# EAGLE design M306X (EAGLE 6.6.0)
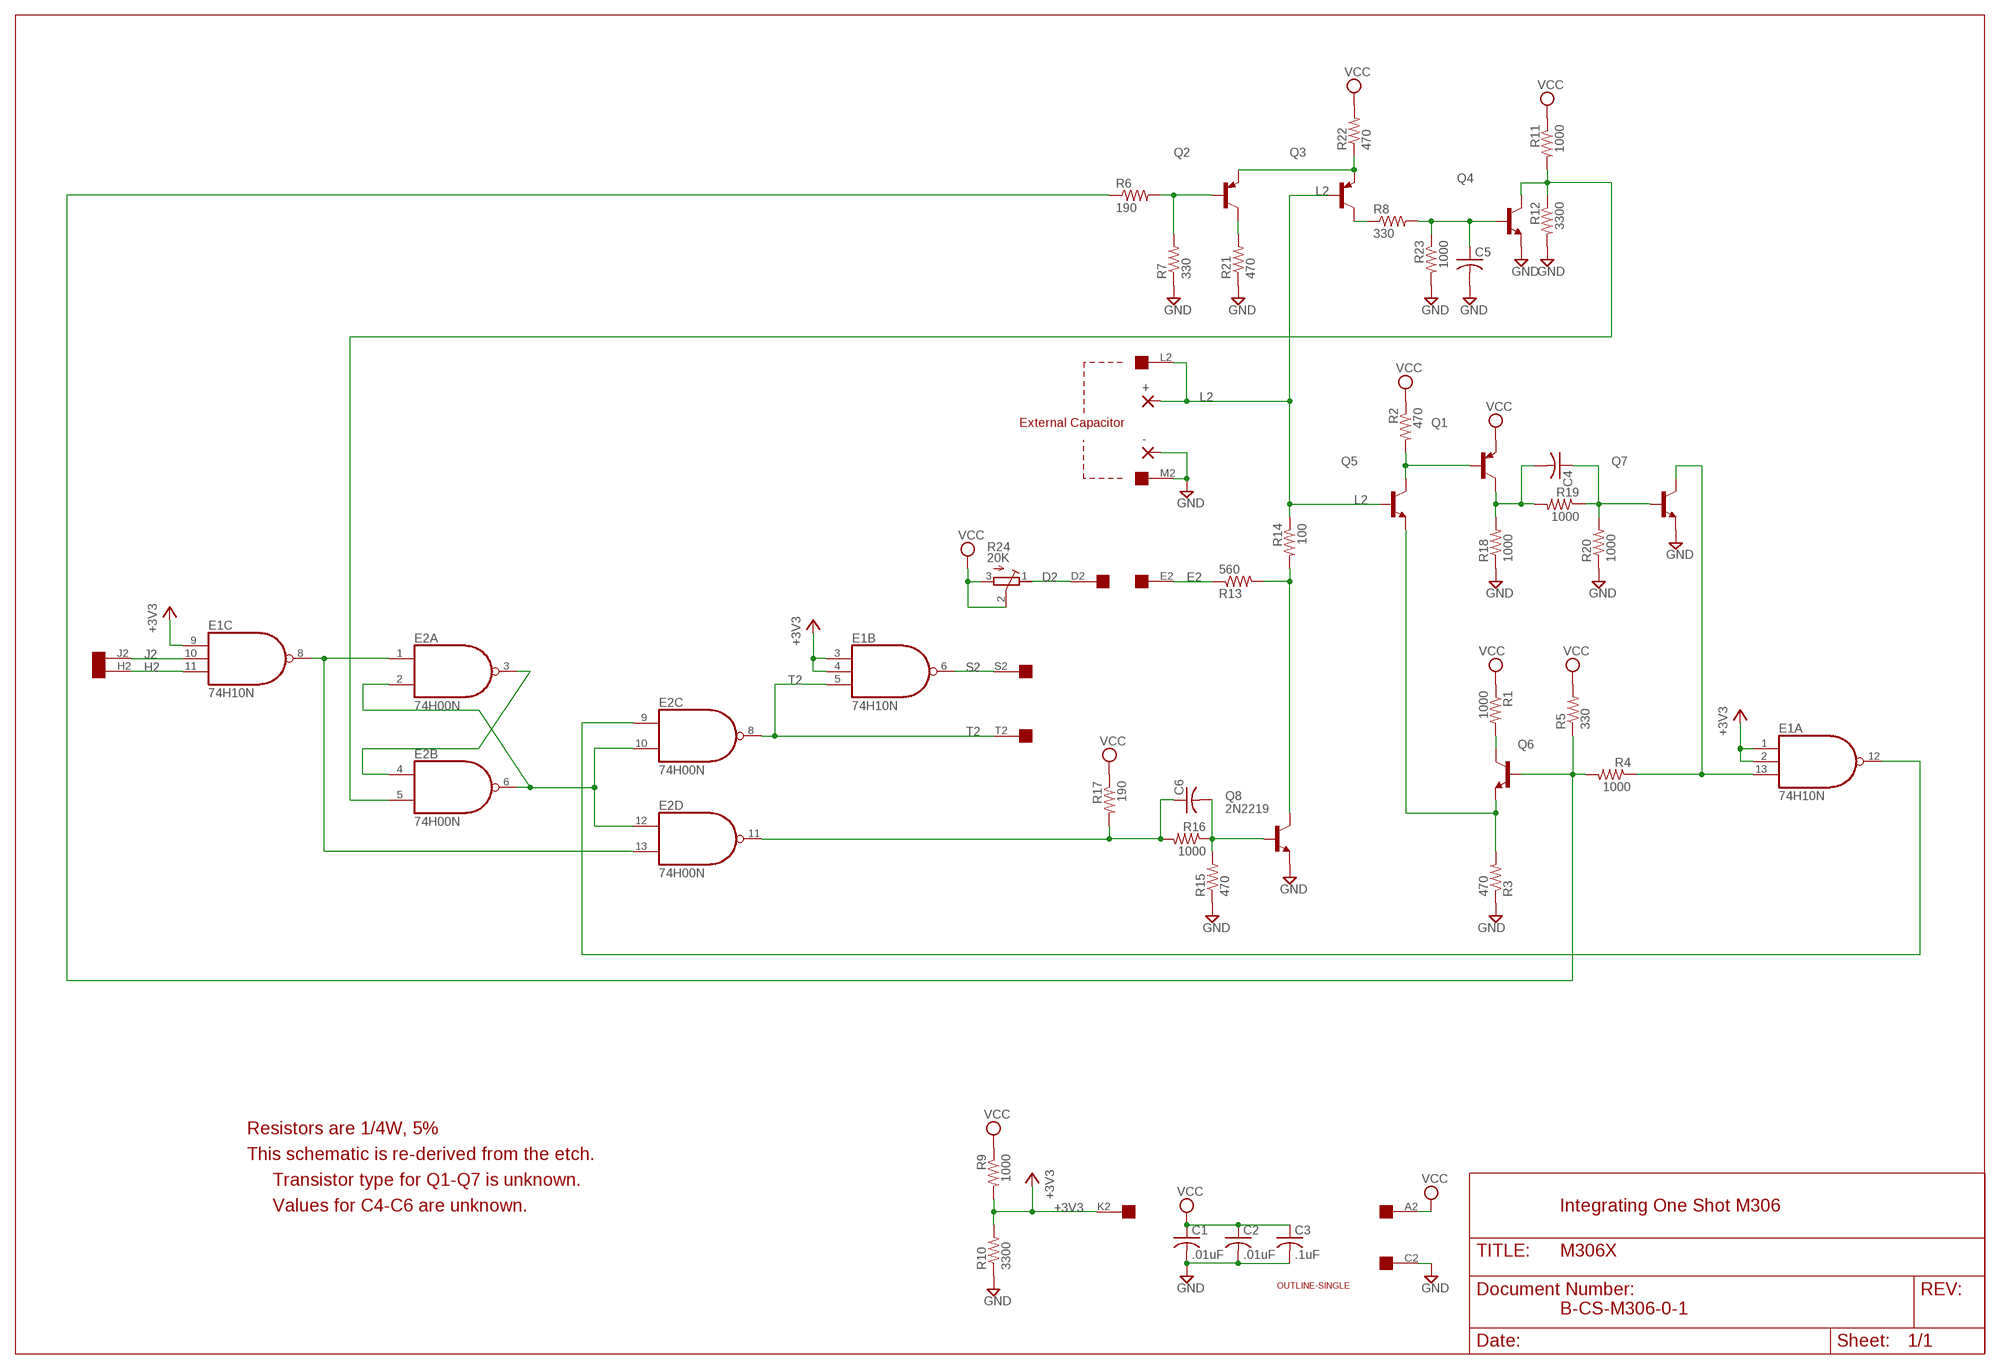
[diagram p0: schematic, sheet 1]

## Parts
+  3,17/1,3  [3,17/1,3]
-  3,17/1,3  [3,17/1,3]
C1  .01uF  C-US050-025X075  [C050-025X075]
C2  .01uF  C-US050-025X075  [C050-025X075]
C3  .1uF  C-US102-043X133  [C102-043X133]
C4  C-US075-032X103  [C075-032X103]
C5  C-US075-032X103  [C075-032X103]
C6  C-US075-032X103  [C075-032X103]
E1  74H10N  7410N  [DIL14]
E2  74H00N  7400N  [DIL14]
Q1  -PNP-TO5  [TO5]
Q2  -PNP-TO5  [TO5]
Q3  -PNP-TO5  [TO5]
Q4  2N3019-NPN-TO39-EBC  [TO39]
Q5  2N3019-NPN-TO39-EBC  [TO39]
Q6  2N3019-NPN-TO39-EBC  [TO39]
Q7  2N3019-NPN-TO39-EBC  [TO39]
Q8  2N2219  [TO5]
R1  1000  R-US_0207/10  [0207/10]
R2  470  R-US_0207/10  [0207/10]
R3  470  R-US_0207/10  [0207/10]
R4  1000  R-US_0207/10  [0207/10]
R5  330  R-US_0207/10  [0207/10]
R6  190  R-US_0207/10  [0207/10]
R7  330  R-US_0207/10  [0207/10]
R8  330  R-US_0207/10  [0207/10]
R9  1000  R-US_0207/10  [0207/10]
R10  3300  R-US_0207/10  [0207/10]
R11  1000  R-US_0207/10  [0207/10]
R12  3300  R-US_0207/10  [0207/10]
R13  560  R-US_0207/10  [0207/10]
R14  100  R-US_0207/10  [0207/10]
R15  470  R-US_0207/10  [0207/10]
R16  1000  R-US_0207/10  [0207/10]
R17  190  R-US_0207/10  [0207/10]
R18  1000  R-US_0207/10  [0207/10]
R19  1000  R-US_0207/10  [0207/10]
R20  1000  R-US_0207/10  [0207/10]
R21  470  R-US_0207/10  [0207/10]
R22  470  R-US_0207/10  [0207/10]
R23  1000  R-US_0207/10  [0207/10]
R24  20K  275P  [3006Y]
U$1  SINGLE  [EDGE-CON2]
U$2  OUTLINE-SINGLE  [SINGLE]

## Nets
+3V3: E1.1(A:I0) E1.2(A:I1) E1.3(B:I0) E1.4(B:I1) E1.9(C:I0) R9.2 R10.2 U$1.K2
D2: R24.1(A) U$1.D2
E2: R13.1 U$1.E2
GND [power]: -.1(P) C1.2 C2.2 C3.2 C5.2 Q4.1(E) Q7.1(E) Q8.1(E) R3.1 R7.1 R10.1 R12.2 R15.1 R18.1 R20.1 R21.1 R23.2 U$1.C2 U$1.M2
H2: E1.11(C:I2) U$1.H2
J2: E1.10(C:I1) U$1.J2
L2: +.1(P) Q3.2(B) Q5.2(B) R14.1 U$1.L2
N$2: C6.1 E2.11(D:O) R16.2 R17.2
N$4: C6.2 Q8.2(B) R15.2 R16.1
N$5: Q8.3(C) R13.2 R14.2
N$8: E2.5(B:I1) Q4.3(C) R11.2 R12.1
N$11: C5.1 Q4.2(B) R8.2 R23.1
N$12: Q2.2(B) R6.2 R7.2
N$13: Q6.3(C) R1.2
N$14: Q1.2(B) Q5.3(C) R2.2
N$15: Q5.1(E) Q6.1(E) R3.2
N$16: Q6.2(B) R4.2 R5.1 R6.1
N$28: Q3.3(C) R8.1
N$33: E1.13(A:I2) Q7.3(C) R4.1
N$52: C4.1 Q7.2(B) R19.1 R20.2
N$57: E1.8(C:O) E2.1(A:I0) E2.13(D:I1)
N$59: E1.12(A:O) E2.9(C:I0)
N$70: E2.2(A:I1) E2.6(B:O) E2.10(C:I1) E2.12(D:I0)
N$71: E2.3(A:O) E2.4(B:I0)
N$83: C4.2 Q1.3(C) R18.2 R19.2
N$90: Q2.1(E) Q3.1(E) R22.1
N$94: Q2.3(C) R21.2
S2: E1.6(B:O) U$1.S2
T2: E1.5(B:I2) E2.8(C:O) U$1.T2
VCC [power]: C1.1 C2.1 C3.1 Q1.1(E) R1.1 R2.1 R5.2 R9.1 R11.1 R17.1 R22.2 R24.2(S) R24.3(E) U$1.A2
Unconnected: U$1.A1 U$1.B1 U$1.B2 U$1.C1 U$1.D1 U$1.E1 U$1.F1 U$1.F2 U$1.H1 U$1.J1 U$1.K1 U$1.L1 U$1.M1 U$1.N1 U$1.N2 U$1.P1 U$1.P2 U$1.R1 U$1.R2 U$1.S1 U$1.T1 U$1.U1 U$1.U2 U$1.V1 U$1.V2

## Notes on the sheet
- External Capacitor
- Resistors are 1/4W, 5%
- This schematic is re-derived from the etch.
- Transistor type for Q1-Q7 is unknown.
- Values for C4-C6 are unknown. | Integrating One Shot M306
- B-CS-M306-0-1

## Power pins joined to a net without a drawn wire
GND: E1.7(P:GND) E2.7(P:GND)
VCC: E1.14(P:VCC) E2.14(P:VCC)

## Library data of the parts
+ - = wirepad:3,17/1,3: THROUGH-HOLE PAD
C1-C6 = rcl:C-US: CAPACITOR, American symbol
E1 = 74xx-us:74*10: Triple 3-input NAND gate
E2 = 74xx-us:74*00: Quad 2-input NAND gate
Q1-Q3 = transistor:*-PNP-: PNP Transistror
Q4-Q7 = transistor:*-NPN-: NPN Transistror BF959 corrected 2008.03.06
Q8 = transistor-npn:2N2219: NPN Transistor
R1-R23 = rcl:R-US_: RESISTOR, American symbol
R24 = dec-con:275P: Trimpot with 275P (3006Y) footprint.
U$1 = dec-con:SINGLE: Single-Height DEC board
U$2 = dec-con:OUTLINE-*: Board outlines for DEC boards.

## Net classes
1 power: width 0.813 mm

## Board
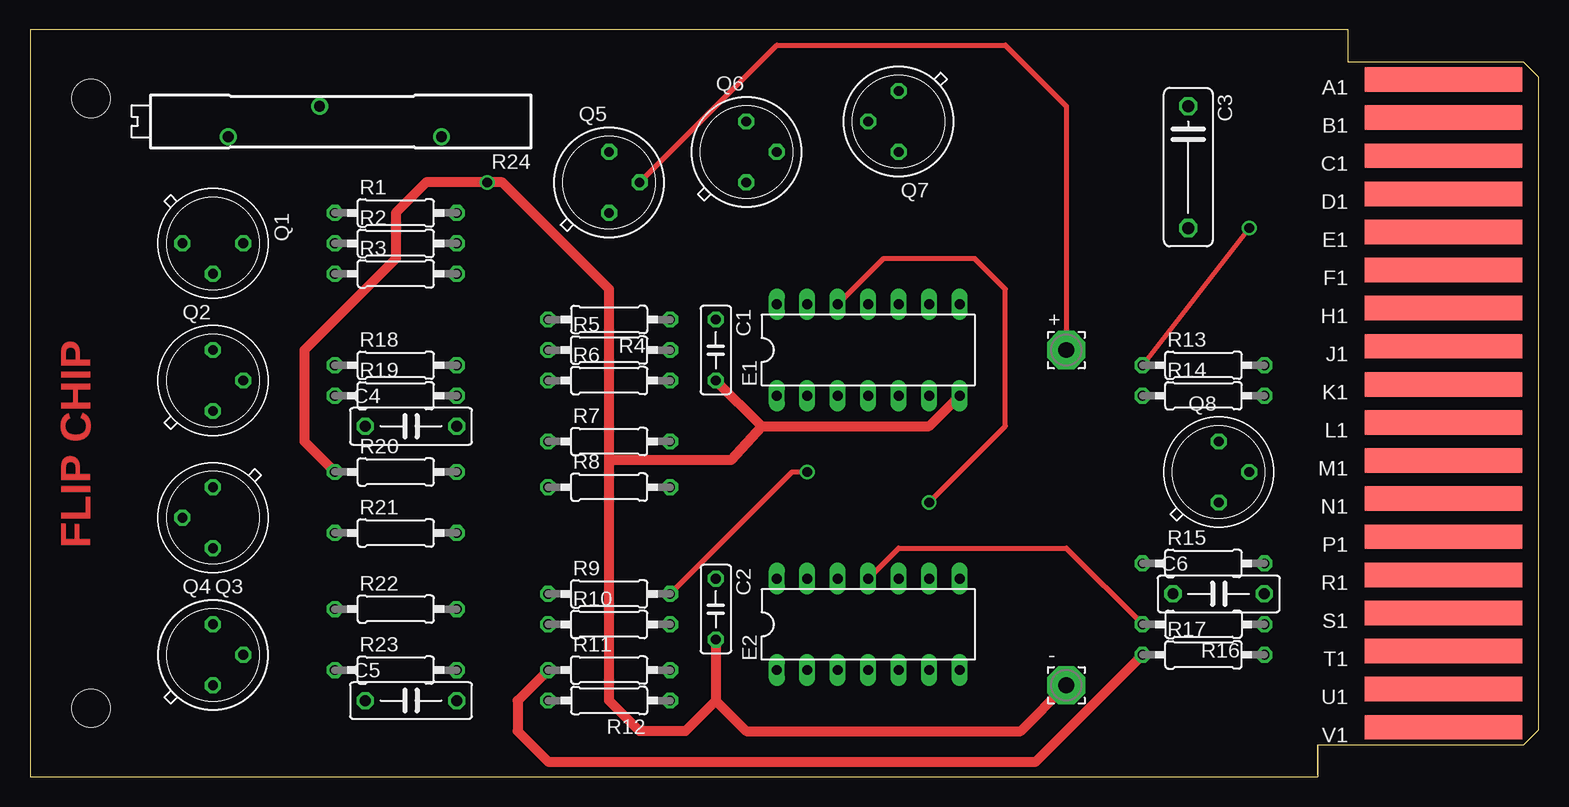
[diagram p1: board, top side]
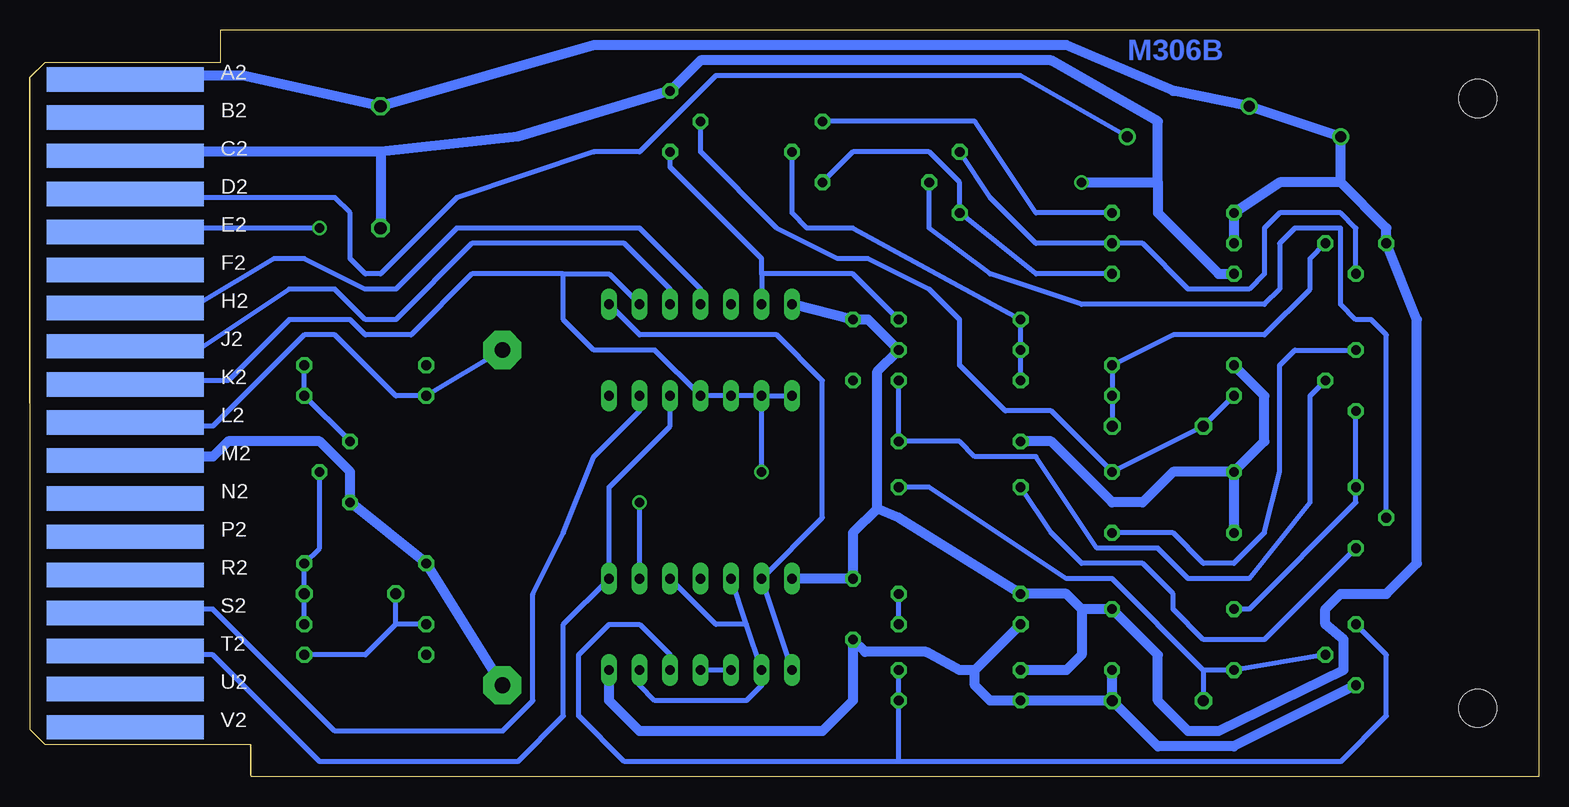
[diagram p2: board, bottom side, seen from below]

Size 125.73 x 62.23 mm. Coordinates in mm from the lower left corner, seen from the top.
Copper layers (1+16): Top 0.035mm / dielectric 1.5mm / Bottom 0.035mm
Design rules "16mils": minimum track width 16mil, minimum drill 32mil, track to track 15mil, track to pad 10mil, pad to pad 10mil, via to via 10mil, smd to smd 10mil, copper to edge 13mil, drill to drill 10mil, minimum pad ring 10mil, minimum via ring 8mil, stop-mask expansion 0mil, vias tented up to drill 0mil, thermal gap 10mil

### Footprints (pad centres in the part's own frame; a part is rotated, then mirrored left to right if it is on the bottom)
3,17/1,3 = drill 1.321 pad 3.175 octagon: 1 0,0
C050-025X075 = drill 0.813 octagon: 1 -2.54,0; 2 2.54,0
C102-043X133 = drill 1.016 octagon: 1 -5.08,0; 2 5.08,0
C075-032X103 = drill 0.914 octagon: 1 -3.81,0; 2 3.81,0
DIL14 = drill 0.813 long: 1 -7.62,-3.81; 2 -5.08,-3.81; 3 -2.54,-3.81; 4 0,-3.81; 5 2.54,-3.81; 6 5.08,-3.81; 7 7.62,-3.81; 8 7.62,3.81; 9 5.08,3.81; 10 2.54,3.81; 11 0,3.81; 12 -2.54,3.81; 13 -5.08,3.81; 14 -7.62,3.81
TO5 = drill 0.813 octagon: 1 0,-2.54; 2 2.54,0; 3 0,2.54
TO39 = drill 0.813 octagon: 1 0,-2.54; 2 2.54,0; 3 0,2.54
0207/10 = drill 0.813 octagon: 1 -5.08,0; 2 5.08,0
3006Y = drill 0.9: 1 -8.89,1.27; 2 1.27,-1.27; 3 8.89,1.27
EDGE-CON2 = smd 13.106 x 2.032: A1 7.938,4.128; B1 7.938,7.303; C1 7.938,10.477; D1 7.938,13.652; E1 7.938,16.828; F1 7.938,20.003; H1 7.938,23.177; J1 7.938,26.352; K1 7.938,29.527; L1 7.938,32.703; M1 7.938,35.877; N1 7.938,39.053; P1 7.938,42.227; R1 7.938,45.403; S1 7.938,48.578; T1 7.938,51.752; U1 7.938,54.928; V1 7.938,58.102 | smd 13.106 x 2.032 bottom: A2 7.938,4.128; B2 7.938,7.303; C2 7.938,10.477; D2 7.938,13.652; E2 7.938,16.828; F2 7.938,20.003; H2 7.938,23.177; J2 7.938,26.352; K2 7.938,29.527; L2 7.938,32.703; M2 7.938,35.877; N2 7.938,39.053; P2 7.938,42.227; R2 7.938,45.403; S2 7.938,48.578; T2 7.938,51.752; U2 7.938,54.928; V2 7.938,58.102
SINGLE = hole 3.175: 120.65,56.515; 120.65,5.715

### Placement (x,y rotation side)
+  86.36,35.56 0 top
-  86.36,7.62 0 top
C1  57.15,35.56 270 top
C2  57.15,13.97 270 top
C3  96.52,50.8 270 top
C4  31.75,29.21 0 top
C5  31.75,6.35 0 top
C6  99.06,15.24 0 top
E1  69.85,35.56 0 top
E2  69.85,12.7 0 top
Q1  15.24,44.45 270 top
Q2  15.24,33.02 0 top
Q3  15.24,21.59 180 top
Q4  15.24,10.16 0 top
Q5  48.26,49.53 0 top
Q6  59.69,52.07 0 top
Q7  72.39,54.61 180 top
Q8  99.06,25.4 0 top
R1  30.48,46.99 0 top
R2  30.48,44.45 0 top
R3  30.48,41.91 0 top
R4  48.26,38.1 180 top
R5  48.26,35.56 0 top
R6  48.26,33.02 0 top
R7  48.26,27.94 0 top
R8  48.26,24.13 0 top
R9  48.26,15.24 0 top
R10  48.26,12.7 0 top
R11  48.26,8.89 0 top
R12  48.26,6.35 180 top
R13  97.79,34.29 0 top
R14  97.79,31.75 0 top
R15  97.79,17.78 0 top
R16  97.79,12.7 180 top
R17  97.79,10.16 0 top
R18  30.48,34.29 0 top
R19  30.48,31.75 0 top
R20  30.48,25.4 0 top
R21  30.48,20.32 0 top
R22  30.48,13.97 0 top
R23  30.48,8.89 0 top
R24  25.4,54.61 180 top
U$1  125.73,62.23 180 top
U$2  125.73,62.23 180 top
U$3  [FLIPCHIP]  0,0 0 top

### Tracks (layer width: path | path; a pad name or v marks a point on that pad's centre or on a via)
+3V3  (via drill 0.81)
  Top 0.406: v64.77,25.4 63.5,25.4 R9.2
  Bottom 0.406: E1.2 E1.1 | E1.2 E1.3 E1.4 73.66,35.56 78.74,35.56 81.28,38.1 81.28,41.91 | v64.77,25.4 E1.2 | 81.28,41.91 77.47,41.91 E1.9 | 81.28,41.91 88.9,41.91 93.98,36.83 97.79,36.83 99.06,38.1 104.14,38.1 109.22,33.02 116.84,33.02 117.14,32.72 U$1.K2 | R10.2 R9.2
D2
  Bottom 0.406: U$1.D2 117.14,48.56 116.84,48.26 100.33,48.26 99.06,46.99 99.06,43.18 97.79,41.91 96.52,41.91 90.17,48.26 78.74,52.07 74.93,52.07 68.58,58.42 43.18,58.42 R24.1
E2  (via drill 0.81)
  Top 0.406: R13.1 v101.6,45.72
  Bottom 0.406: U$1.E2 117.17,45.39 116.84,45.72 v101.6,45.72
GND  (via drill 0.81)
  Top 0.813: E1.7 74.93,29.21 60.96,29.21 | 60.96,29.21 C1.2 | 48.26,26.42 48.26,40.64 39.37,49.53 v38.1,49.53 33.02,49.53 30.48,46.99 30.48,43.18 22.86,35.56 22.86,27.94 R20.1 | 60.96,29.21 58.42,26.42 48.26,26.42 | C2.2 57.15,6.35 | 57.15,6.35 54.61,3.81 50.8,3.81 48.26,6.35 48.26,26.42 | 57.15,6.35 59.69,3.81 82.55,3.81 -.1
  Bottom 0.813: E2.7 77.47,6.35 74.93,3.81 59.69,3.81 57.15,6.35 C2.2 56.13,10.41 51.05,10.41 48.26,8.89 46.99,8.89 | C5.2 R12.2 45.72,6.35 46.99,7.62 46.99,8.89 | C5.2 R23.2 | C5.2 31.75,2.54 25.4,2.54 Q4.1 | 46.99,8.89 R10.1 | U$1.C2 117.17,51.74 116.84,52.07 96.52,52.07 | 96.52,52.07 C3.2 | 96.52,52.07 85.09,53.34 Q7.1 69.85,59.69 40.64,59.69 31.75,54.61 31.75,49.53 | v38.1,49.53 31.75,49.53 | 31.75,49.53 31.75,46.99 26.67,41.91 R3.1 | -.1 R15.1 Q8.1 99.06,25.4 101.6,27.94 109.22,27.94 110.49,26.67 116.84,26.67 117.17,26.34 U$1.M2 | R7.1 40.64,27.94 35.56,22.86 33.02,22.86 30.48,25.4 R20.1 | R18.1 22.86,31.75 22.86,27.94 R20.1 | R20.1 R21.1
H2
  Bottom 0.406: E1.11 69.85,40.64 74.93,45.72 90.17,45.72 95.25,40.64 97.79,40.64 102.87,43.18 105.41,43.18 111.76,39.37 116.84,39.37 117.17,39.04 U$1.H2
J2
  Bottom 0.406: E1.10 72.39,40.64 76.2,44.45 88.9,44.45 95.25,38.1 97.79,38.1 100.33,40.64 104.14,40.64 111.76,35.56 116.84,35.56 117.17,35.89 U$1.J2
L2
  Top 0.406: Q5.2 62.23,60.96 81.28,60.96 86.36,55.88 +.1
  Bottom 0.406: +.1 R14.1 95.25,31.75 100.33,36.83 102.87,36.83 110.49,29.21 116.84,29.21 117.17,29.54 U$1.L2 | Q5.2 50.8,45.72 45.72,41.91 38.1,39.37 22.86,39.37 21.59,40.64 21.59,44.45 20.32,45.72 16.51,45.72 16.51,39.37 15.24,38.1 13.97,38.1 12.7,36.83 Q3.2
N$2
  Top 0.406: E2.11 72.39,19.05 86.36,19.05 R16.2
  Bottom 0.406: 95.25,12.7 C6.1 | R16.2 95.25,12.7 | 95.25,12.7 97.79,10.16 R17.2
N$4
  Bottom 0.406: R16.1 C6.2 R15.2 101.6,19.05 Q8.2
N$5
  Bottom 0.406: Q8.3 R14.2 R13.2
N$8
  Bottom 0.406: Q4.3 12.7,10.16 12.7,5.08 16.51,1.27 53.34,1.27 | 53.34,1.27 R12.1 R11.2 | 53.34,1.27 76.2,1.27 80.01,5.08 80.01,10.16 77.47,12.7 74.93,12.7 72.39,10.16 E2.5
N$11
  Bottom 0.406: R8.2 50.8,24.13 39.37,16.51 35.56,16.51 27.94,8.89 | Q4.2 R23.1 27.94,8.89 | 27.94,8.89 C5.1
N$12
  Bottom 0.406: R6.2 R7.2 48.26,27.94 46.99,26.67 41.91,26.67 36.83,19.05 31.75,19.05 29.21,16.51 24.13,16.51 19.05,22.86 19.05,31.75 Q2.2
N$13
  Bottom 0.406: Q6.3 46.99,54.61 41.91,46.99 R1.2
N$14
  Bottom 0.406: Q5.3 45.72,48.26 41.91,44.45 R2.2 33.02,44.45 29.21,40.64 24.13,40.64 22.86,41.91 22.86,45.72 21.59,46.99 16.51,46.99 15.24,45.72 Q1.2
N$15
  Bottom 0.406: R3.2 41.91,41.91 Q5.1 48.26,49.53 50.8,52.07 57.15,52.07 Q6.1
N$16
  Bottom 0.406: R6.1 R5.1 R4.2 57.15,45.72 60.96,45.72 62.23,46.99 Q6.2
N$28
  Bottom 0.406: Q3.3 22.86,11.43 27.94,11.43 30.48,13.97 30.48,15.24 33.02,17.78 38.1,17.78 40.64,20.32 R8.1
N$33
  Bottom 0.406: R4.1 57.15,41.91 64.77,41.91 | Q7.3 72.39,50.8 64.77,43.18 64.77,41.91 | 64.77,41.91 E1.13
N$52
  Bottom 0.406: Q7.2 69.85,52.07 63.5,45.72 58.42,43.18 55.88,43.18 50.8,40.64 48.26,38.1 48.26,34.29 44.45,30.48 40.64,30.48 R20.2 C4.1 R19.1
N$57
  Bottom 0.406: E1.8 74.93,36.83 63.5,36.83 59.69,33.02 59.69,21.59 E2.13 E2.1
N$59  (via drill 0.81)
  Top 0.406: E1.12 71.12,43.18 78.74,43.18 81.28,40.64 81.28,29.21 v74.93,22.86
  Bottom 0.406: E2.9 v74.93,22.86
N$70
  Bottom 0.406: E2.6 74.93,7.62 73.66,6.35 66.04,6.35 64.77,7.62 E2.2 66.04,12.7 | 66.04,12.7 E2.12 | E2.10 68.58,12.7 66.04,12.7
N$71
  Bottom 0.406: E2.3 E2.4
N$83
  Bottom 0.406: Q1.3 19.05,43.18 19.05,40.64 22.86,36.83 30.48,36.83 R18.2 R19.2 C4.2
N$90
  Bottom 0.406: Q2.1 Q3.1 15.24,22.86 24.13,13.97 R22.1
N$94
  Bottom 0.406: R21.2 30.48,20.32 27.94,17.78 25.4,17.78 22.86,20.32 21.59,25.4 21.59,34.29 20.32,35.56 Q2.3
S2
  Bottom 0.406: E1.6 74.93,30.48 78.74,26.67 81.28,20.32 83.82,15.24 83.82,6.35 86.36,3.81 100.33,3.81 110.49,13.97 116.84,13.97 117.14,13.66 U$1.S2
T2
  Bottom 0.406: E1.5 72.39,29.21 77.47,24.13 E2.8 81.28,12.7 81.28,5.08 85.09,1.27 101.6,1.27 110.49,10.16 116.84,10.16 117.17,10.49 U$1.T2
VCC
  Top 0.813: R17.1 83.82,1.27 43.18,1.27 40.64,3.81 40.64,6.35 R11.1
  Bottom 0.813: E1.14 C1.1 55.88,38.1 R5.2 55.12,33.78 55.12,22.35 | 55.12,22.35 57.15,20.32 C2.1 E2.14 | 55.12,22.35 53.34,21.59 R9.1 39.37,15.24 38.1,13.97 | 38.1,13.97 R22.2 31.75,10.16 31.75,6.35 29.21,3.81 26.67,3.81 16.26,8.89 16.26,11.43 17.78,12.7 17.78,13.97 16.51,15.24 12.7,15.24 10.16,17.78 10.16,38.1 Q1.1 12.7,45.72 16.51,49.53 | U$1.A2 117.24,58.02 116.84,58.42 107.95,58.42 C3.1 78.74,60.96 39.37,60.96 30.48,57.15 R24.2 R24.3 16.51,49.53 | 16.51,49.53 21.59,49.53 R1.1 R2.1 | 38.1,13.97 38.1,10.16 39.37,8.89 R11.1

### Text on the board
Bottom: M306B